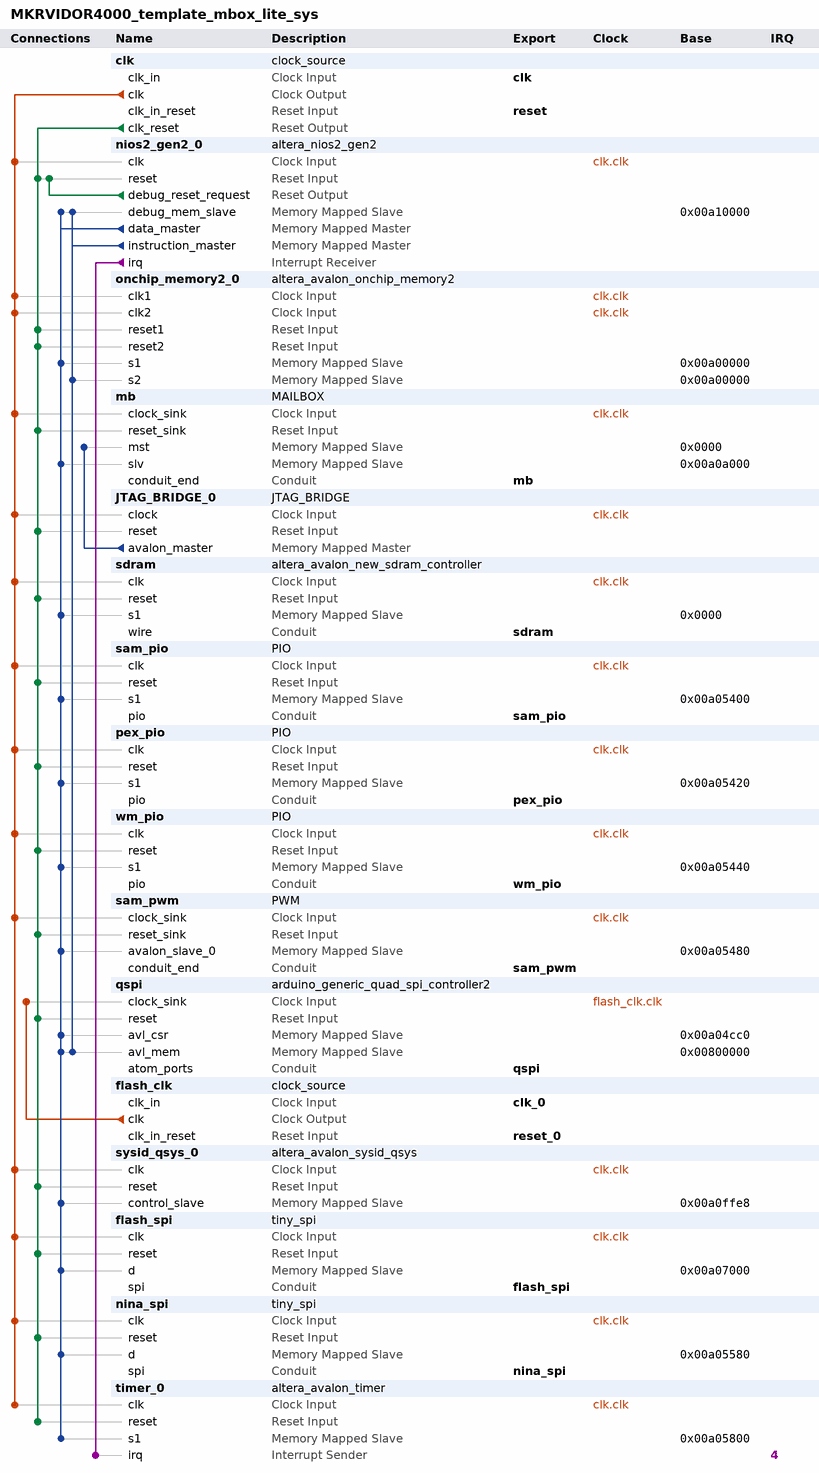
[diagram p0: system contents]
# Platform Designer (Qsys) system MKRVIDOR4000_template_mbox_lite_sys, Cyclone 10 LP 10CL016YU256C8G
# Parameters at their usual value, and those the tool derives, are not listed.
package require -exact qsys 18.1
create_system MKRVIDOR4000_template_mbox_lite_sys
set_project_property DEVICE_FAMILY {Cyclone 10 LP}
set_project_property DEVICE 10CL016YU256C8G

add_instance clk clock_source 18.1
set_instance_parameter_value clk clockFrequency 100000000

add_instance nios2_gen2_0 altera_nios2_gen2 18.1
set_instance_parameter_value nios2_gen2_0 cpuID 531
set_instance_parameter_value nios2_gen2_0 dcache_size 2048
set_instance_parameter_value nios2_gen2_0 debug_hwbreakpoint 4
set_instance_parameter_value nios2_gen2_0 exceptionSlave onchip_memory2_0.s2
set_instance_parameter_value nios2_gen2_0 icache_size 8192
set_instance_parameter_value nios2_gen2_0 impl Tiny
set_instance_parameter_value nios2_gen2_0 io_regionbase 10485760
set_instance_parameter_value nios2_gen2_0 resetSlave onchip_memory2_0.s2
set_instance_parameter_value nios2_gen2_0 setting_interruptControllerType External
set_instance_parameter_value nios2_gen2_0 setting_shadowRegisterSets 1

add_instance onchip_memory2_0 altera_avalon_onchip_memory2 18.1
set_instance_parameter_value onchip_memory2_0 dataWidth 32
set_instance_parameter_value onchip_memory2_0 dualPort true
set_instance_parameter_value onchip_memory2_0 initMemContent true
set_instance_parameter_value onchip_memory2_0 initializationFileName onchip_mem.hex
set_instance_parameter_value onchip_memory2_0 memorySize 16384

add_instance mb MAILBOX 1.0
set_instance_parameter_value mb pDPRAM_BITS 9
set_instance_parameter_value mb pFIFO_BITS 4

add_instance JTAG_BRIDGE_0 JTAG_BRIDGE 1.0

add_instance sdram altera_avalon_new_sdram_controller 18.1
set_instance_parameter_value sdram TAC 5.4
set_instance_parameter_value sdram TRCD 20.0
set_instance_parameter_value sdram TRP 20.0
set_instance_parameter_value sdram casLatency 2
set_instance_parameter_value sdram columnWidth 8
set_instance_parameter_value sdram dataWidth 16
set_instance_parameter_value sdram generateSimulationModel false
set_instance_parameter_value sdram model single_Micron_MT48LC4M32B2_7_chip
set_instance_parameter_value sdram numberOfBanks 4
set_instance_parameter_value sdram numberOfChipSelects 1
set_instance_parameter_value sdram powerUpDelay 200.0
set_instance_parameter_value sdram refreshPeriod 31.25
set_instance_parameter_value sdram rowWidth 12

add_instance sam_pio PIO 1.0
set_instance_parameter_value sam_pio pBITS 32
set_instance_parameter_value sam_pio pMUX_BITS 2

add_instance pex_pio PIO 1.0
set_instance_parameter_value pex_pio pBITS 32
set_instance_parameter_value pex_pio pMUX_BITS 2

add_instance wm_pio PIO 1.0
set_instance_parameter_value wm_pio pBITS 32
set_instance_parameter_value wm_pio pMUX_BITS 2

add_instance sam_pwm PWM 1.0
set_instance_parameter_value sam_pwm pCHANNELS 23
set_instance_parameter_value sam_pwm pMATCH_BITS 16
set_instance_parameter_value sam_pwm pPRESCALER_BITS 32

add_instance qspi arduino_generic_quad_spi_controller2 18.1
set_instance_parameter_value qspi ATOM UNIDIRECTIONAL
set_instance_parameter_value qspi CHIP_SELS 1
set_instance_parameter_value qspi DDASI 1
set_instance_parameter_value qspi FLASH_TYPE N25Q16
set_instance_parameter_value qspi GUI_USE_GPIO false
set_instance_parameter_value qspi IO_MODE QUAD
set_instance_parameter_value qspi clkFreq 40000000

add_instance flash_clk clock_source 18.1
set_instance_parameter_value flash_clk clockFrequency 40000000

add_instance sysid_qsys_0 altera_avalon_sysid_qsys 18.1
set_instance_parameter_value sysid_qsys_0 id -1161707801

add_instance flash_spi tiny_spi 1.0
set_instance_parameter_value flash_spi BAUD_DIV 0
set_instance_parameter_value flash_spi BAUD_WIDTH 8
set_instance_parameter_value flash_spi SPI_MODE 0

add_instance nina_spi tiny_spi 1.0
set_instance_parameter_value nina_spi BAUD_DIV 0
set_instance_parameter_value nina_spi BAUD_WIDTH 8
set_instance_parameter_value nina_spi SPI_MODE 0

add_instance timer_0 altera_avalon_timer 18.1
set_instance_parameter_value timer_0 period 1
set_instance_parameter_value timer_0 periodUnits MSEC

# connections
add_connection clk.clk flash_spi.clk clock
add_connection clk.clk JTAG_BRIDGE_0.clock clock
add_connection clk.clk mb.clock_sink clock
add_connection clk.clk nina_spi.clk clock
add_connection clk.clk nios2_gen2_0.clk clock
add_connection clk.clk onchip_memory2_0.clk1 clock
add_connection clk.clk onchip_memory2_0.clk2 clock
add_connection clk.clk pex_pio.clk clock
add_connection clk.clk sam_pio.clk clock
add_connection clk.clk sam_pwm.clock_sink clock
add_connection clk.clk sdram.clk clock
add_connection clk.clk sysid_qsys_0.clk clock
add_connection clk.clk timer_0.clk clock
add_connection clk.clk wm_pio.clk clock
add_connection flash_clk.clk qspi.clock_sink clock
add_connection clk.clk_reset flash_spi.reset reset
add_connection clk.clk_reset JTAG_BRIDGE_0.reset reset
add_connection clk.clk_reset mb.reset_sink reset
add_connection clk.clk_reset nina_spi.reset reset
add_connection clk.clk_reset nios2_gen2_0.reset reset
add_connection clk.clk_reset onchip_memory2_0.reset1 reset
add_connection clk.clk_reset onchip_memory2_0.reset2 reset
add_connection clk.clk_reset pex_pio.reset reset
add_connection clk.clk_reset qspi.reset reset
add_connection clk.clk_reset sam_pio.reset reset
add_connection clk.clk_reset sam_pwm.reset_sink reset
add_connection clk.clk_reset sdram.reset reset
add_connection clk.clk_reset sysid_qsys_0.reset reset
add_connection clk.clk_reset timer_0.reset reset
add_connection clk.clk_reset wm_pio.reset reset
add_connection nios2_gen2_0.debug_reset_request nios2_gen2_0.reset reset
add_connection JTAG_BRIDGE_0.avalon_master mb.mst avalon
set_connection_parameter_value JTAG_BRIDGE_0.avalon_master/mb.mst baseAddress 0x0000
add_connection nios2_gen2_0.data_master flash_spi.d avalon
set_connection_parameter_value nios2_gen2_0.data_master/flash_spi.d baseAddress 0x00a07000
add_connection nios2_gen2_0.data_master mb.slv avalon
set_connection_parameter_value nios2_gen2_0.data_master/mb.slv baseAddress 0x00a0a000
add_connection nios2_gen2_0.data_master nina_spi.d avalon
set_connection_parameter_value nios2_gen2_0.data_master/nina_spi.d baseAddress 0x00a05580
add_connection nios2_gen2_0.data_master nios2_gen2_0.debug_mem_slave avalon
set_connection_parameter_value nios2_gen2_0.data_master/nios2_gen2_0.debug_mem_slave baseAddress 0x00a10000
add_connection nios2_gen2_0.data_master onchip_memory2_0.s1 avalon
set_connection_parameter_value nios2_gen2_0.data_master/onchip_memory2_0.s1 baseAddress 0x00a00000
add_connection nios2_gen2_0.data_master pex_pio.s1 avalon
set_connection_parameter_value nios2_gen2_0.data_master/pex_pio.s1 baseAddress 0x00a05420
add_connection nios2_gen2_0.data_master qspi.avl_csr avalon
set_connection_parameter_value nios2_gen2_0.data_master/qspi.avl_csr baseAddress 0x00a04cc0
add_connection nios2_gen2_0.data_master qspi.avl_mem avalon
set_connection_parameter_value nios2_gen2_0.data_master/qspi.avl_mem baseAddress 0x00800000
add_connection nios2_gen2_0.data_master sam_pio.s1 avalon
set_connection_parameter_value nios2_gen2_0.data_master/sam_pio.s1 baseAddress 0x00a05400
add_connection nios2_gen2_0.data_master sam_pwm.avalon_slave_0 avalon
set_connection_parameter_value nios2_gen2_0.data_master/sam_pwm.avalon_slave_0 baseAddress 0x00a05480
add_connection nios2_gen2_0.data_master sdram.s1 avalon
set_connection_parameter_value nios2_gen2_0.data_master/sdram.s1 baseAddress 0x0000
add_connection nios2_gen2_0.data_master sysid_qsys_0.control_slave avalon
set_connection_parameter_value nios2_gen2_0.data_master/sysid_qsys_0.control_slave baseAddress 0x00a0ffe8
add_connection nios2_gen2_0.data_master timer_0.s1 avalon
set_connection_parameter_value nios2_gen2_0.data_master/timer_0.s1 baseAddress 0x00a05800
add_connection nios2_gen2_0.data_master wm_pio.s1 avalon
set_connection_parameter_value nios2_gen2_0.data_master/wm_pio.s1 baseAddress 0x00a05440
add_connection nios2_gen2_0.instruction_master nios2_gen2_0.debug_mem_slave avalon
set_connection_parameter_value nios2_gen2_0.instruction_master/nios2_gen2_0.debug_mem_slave baseAddress 0x00a10000
add_connection nios2_gen2_0.instruction_master onchip_memory2_0.s2 avalon
set_connection_parameter_value nios2_gen2_0.instruction_master/onchip_memory2_0.s2 baseAddress 0x00a00000
add_connection nios2_gen2_0.instruction_master qspi.avl_mem avalon
set_connection_parameter_value nios2_gen2_0.instruction_master/qspi.avl_mem baseAddress 0x00800000
add_connection nios2_gen2_0.irq timer_0.irq interrupt
set_connection_parameter_value nios2_gen2_0.irq/timer_0.irq irqNumber 4

# exported interfaces
add_interface clk clock sink
set_interface_property clk EXPORT_OF clk.clk_in
add_interface clk_0 clock sink
set_interface_property clk_0 EXPORT_OF flash_clk.clk_in
add_interface flash_spi conduit end
set_interface_property flash_spi EXPORT_OF flash_spi.spi
add_interface mb conduit end
set_interface_property mb EXPORT_OF mb.conduit_end
add_interface nina_spi conduit end
set_interface_property nina_spi EXPORT_OF nina_spi.spi
add_interface pex_pio conduit end
set_interface_property pex_pio EXPORT_OF pex_pio.pio
add_interface qspi conduit end
set_interface_property qspi EXPORT_OF qspi.atom_ports
add_interface reset reset sink
set_interface_property reset EXPORT_OF clk.clk_in_reset
add_interface reset_0 reset sink
set_interface_property reset_0 EXPORT_OF flash_clk.clk_in_reset
add_interface sam_pio conduit end
set_interface_property sam_pio EXPORT_OF sam_pio.pio
add_interface sam_pwm conduit end
set_interface_property sam_pwm EXPORT_OF sam_pwm.conduit_end
add_interface sdram conduit end
set_interface_property sdram EXPORT_OF sdram.wire
add_interface wm_pio conduit end
set_interface_property wm_pio EXPORT_OF wm_pio.pio

set_interconnect_requirement {$system} qsys_mm.clockCrossingAdapter HANDSHAKE
set_interconnect_requirement {$system} qsys_mm.enableEccProtection FALSE
set_interconnect_requirement {$system} qsys_mm.insertDefaultSlave FALSE
set_interconnect_requirement {$system} qsys_mm.maxAdditionalLatency 1

save_system MKRVIDOR4000_template_mbox_lite_sys.qsys
